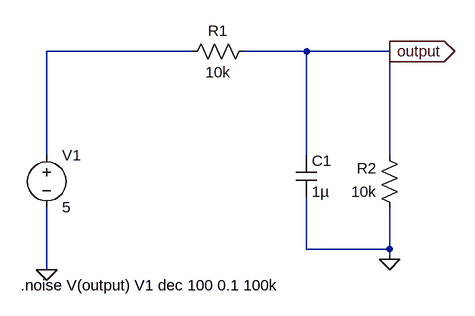
[diagram p0: schematic dc_gurultu_azaltma.asc]
dc_gurultu_azaltma.asc, the LTspice schematic file:
Version 4
SHEET 1 880 680
WIRE 368 -16 144 -16
WIRE 544 -16 448 -16
WIRE 672 -16 544 -16
WIRE 144 144 144 -16
WIRE 544 144 544 -16
WIRE 672 144 672 -16
WIRE 544 288 544 208
WIRE 672 288 672 224
WIRE 672 288 544 288
WIRE 672 304 672 288
WIRE 144 320 144 224
FLAG 672 304 0
FLAG 144 320 0
FLAG 672 -16 output
IOPIN 672 -16 Out
SYMBOL voltage 144 128 R0
WINDOW 123 0 0 Left 0
WINDOW 39 0 0 Left 0
SYMATTR InstName V1
SYMATTR Value 5
SYMBOL res 464 -32 R90
WINDOW 0 0 56 VBottom 2
WINDOW 3 32 56 VTop 2
SYMATTR InstName R1
SYMATTR Value 10k
SYMBOL res 688 240 R180
WINDOW 0 36 76 Left 2
WINDOW 3 36 40 Left 2
SYMATTR InstName R2
SYMATTR Value 10k
SYMBOL cap 528 144 R0
SYMATTR InstName C1
SYMATTR Value 1µ
TEXT 104 344 Left 2 !.noise V(output) V1 dec 100 0.1 100k

The netlist it stands for:
* dc_gurultu_azaltma.asc
V1 N001 0 5
R1 output N001 10k
R2 0 output 10k
C1 output 0 1µ
.noise V(output) V1 dec 100 0.1 100k
.backanno
.end